# EAGLE schematic Drone (EAGLE 9.3.0)
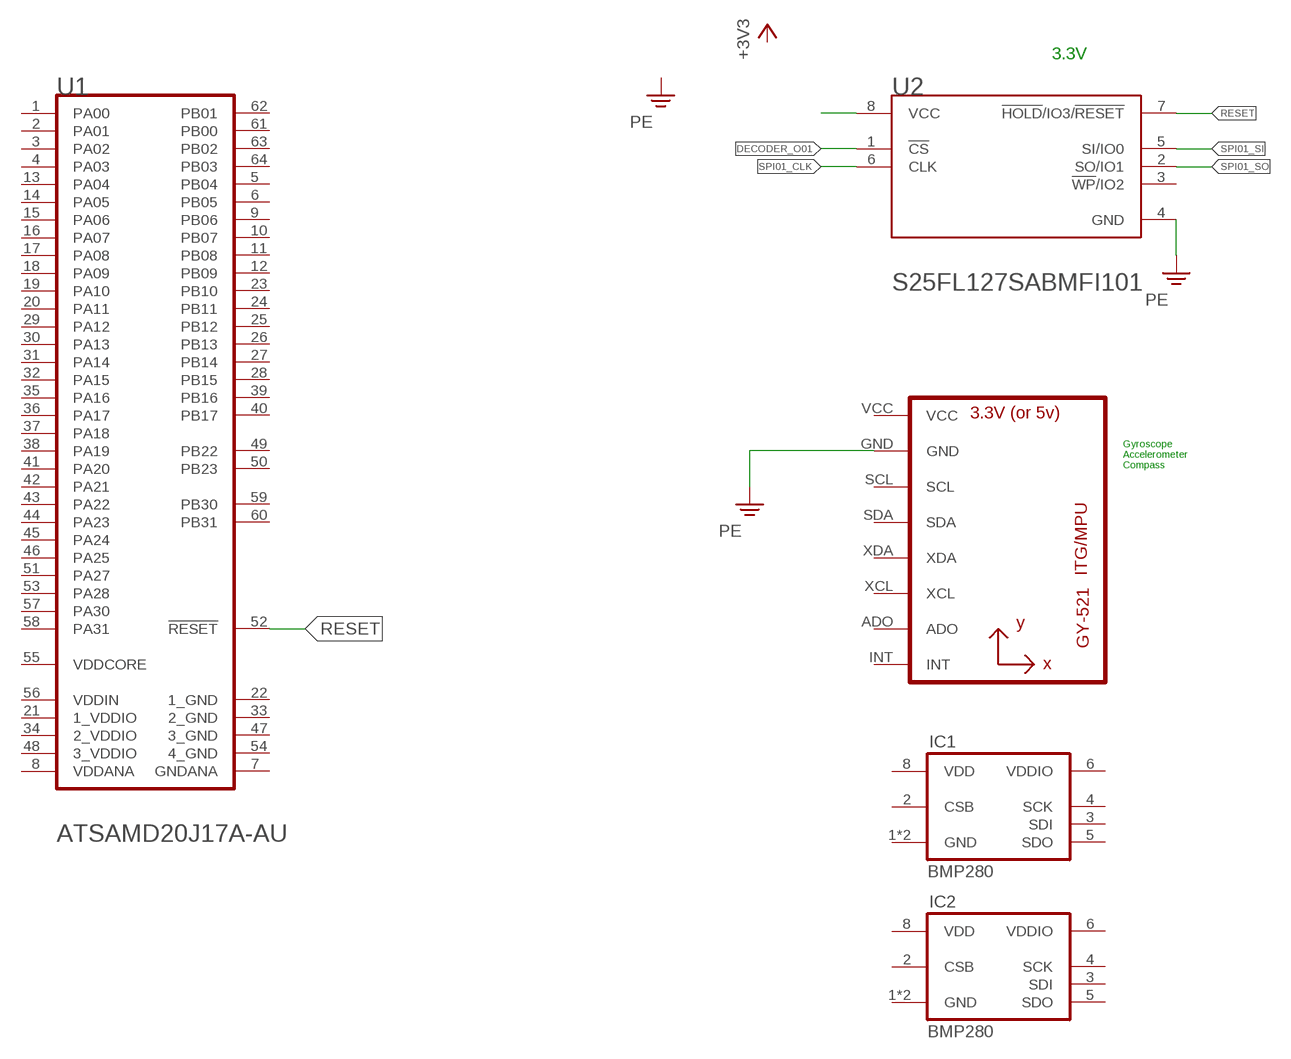
[diagram p0: schematic, sheet 1]

## Parts
IC1  BMP280  [BMP280]
IC2  BMP280  [BMP280]
U1  ATMEL_ATSAMD20J17A-AUATMEL_ATSAMD20J17A-AU_0_0  [ATMEL_ATSAMD20J17A-AU_0]
U2  CYPRESS_S25FL127SABMFI101CYPRESS_S25FL127SABMFI101_0_0  [CYPRESS_S25FL127SABMFI101_0]
U3  GY-521MPU6050  [GY-521]

## Nets
DECODER_O01: U2.1(!CS!)
N$1: U3.GND ; supply symbol labelled PE
N$6: U2.8(VCC)
PE: U2.4(GND)
RESET: U1.52(!RESET!) U2.7(!HOLD!/IO3/!RESET!)
SPI01_CLK: U2.6(CLK)
SPI01_SI: U2.5(SI/IO0)
SPI01_SO: U2.2(SO/IO1)
Unconnected: IC1.2(CSB) IC1.3(SDI) IC1.4(SCK) IC1.5(SDO) IC2.2(CSB) IC2.3(SDI) IC2.4(SCK) IC2.5(SDO) U1.1(PA00) U1.2(PA01) U1.3(PA02) U1.4(PA03) U1.5(PB04) U1.6(PB05) U1.9(PB06) U1.10(PB07) U1.11(PB08) U1.12(PB09) U1.13(PA04) U1.14(PA05) U1.15(PA06) U1.16(PA07) U1.17(PA08) U1.18(PA09) U1.19(PA10) U1.20(PA11) U1.23(PB10) U1.24(PB11) U1.25(PB12) U1.26(PB13) U1.27(PB14) U1.28(PB15) U1.29(PA12) U1.30(PA13) U1.31(PA14) U1.32(PA15) U1.35(PA16) U1.36(PA17) U1.37(PA18) U1.38(PA19) U1.39(PB16) U1.40(PB17) U1.41(PA20) U1.42(PA21) U1.43(PA22) U1.44(PA23) U1.45(PA24) U1.46(PA25) U1.49(PB22) U1.50(PB23) U1.51(PA27) U1.53(PA28) U1.57(PA30) U1.58(PA31) U1.59(PB30) U1.60(PB31) U1.61(PB00) U1.62(PB01) U1.63(PB02) U1.64(PB03) U2.3(!WP!/IO2) U3.ADO U3.INT U3.SCL U3.SDA U3.VCC U3.XCL U3.XDA

## Notes on the sheet
- 3.3V
- Gyroscope
  Accelerometer
  Compass

## Power pins joined to a net without a drawn wire
1_GND: U1.22(1_GND)
1_VDDIO: U1.21(1_VDDIO)
2_GND: U1.33(2_GND)
2_VDDIO: U1.34(2_VDDIO)
3_GND: U1.47(3_GND)
3_VDDIO: U1.48(3_VDDIO)
4_GND: U1.54(4_GND)
GND: IC1.1(GND) IC1.7(GND) IC2.1(GND) IC2.7(GND)
GNDANA: U1.7(GNDANA)
VDD: IC1.8(VDD) IC2.8(VDD)
VDDANA: U1.8(VDDANA)
VDDCORE: U1.55(VDDCORE)
VDDIN: U1.56(VDDIN)
VDDIO: IC1.6(VDDIO) IC2.6(VDDIO)

## Library data of the parts
IC1 IC2 = Drone:BMP280: The BMP280 is an absolute barometric pressure sensor especially designed for mobile applications. The sensor module is housed in an extremely compact 8-pin metal-lid LGA package with a footprint of only 2.0 × 2.5 mm2 and 0.95 mm package height. Its small dimensions and its low power consumption of 2.7 μA @1Hz allow the implementation in battery driven devices such as mobile phones, GPS modules or watches. The library has been designed by Richard Magdycz <https://www.facebook.com/groups/eaglecadsoftUK>
U1 = Drone:ATMEL_ATSAMD20J17A-AU: ATML-ATSAMD20J-TQFP-64; CIIVA_IDS: 12547221; COMPONENT_LINK_1_DESCRIPTION: Manufacturer URL; COMPONENT_LINK_1_URL: http://www.atmel.com/; COMPONENT_LINK_3_DESCRIPTION: Package Specification; COMPONENT_LINK_3_URL: http://www.atmel.com/images/atmel-42129-sam-d20_datasheet.pdf; CPU_FREQUENCY: 48 MHz Max.; DATASHEET: http://www.atmel.com/images/atmel-42129-sam-d20_datasheet.pdf; DATASHEET_VERSION: Rev. N; FLASH_MEMORY_DENSITY: 128 KB; FOOTPRINT_VARIANT_NAME_0: Level C; FOOTPRINT_VARIANT_NAME_1: Level B; FOOTPRINT_VARIANT_NAME_2: Level A; GPIOS: 52; IMPORTED: yes; IMPORTED_FROM: vault; IMPORT_TS: 1521864266; MF: Atmel; MOUNTING_TECHNOLOGY: Surface Mount; MPN: ATSAMD20J17A-AU; PACKAGE_DESCRIPTION: 64-Pin Thin Quad Flat Package, Body 10 x 10 mm, Pitch 0.5 mm; PACKING: Tray; PREFIX: U; RELEASE_DATE: 1433216411; ROHS: Yes; SRAM: 16 KB; TEMPERATURE_RANGE: -40 to 85 degC; VAULT_GUID: 7D63B50C-1B09-490E-BEBA-7AAF9C40A39C; VAULT_REVISION: 941F293A-D347-464E-A457-C88536A4F078; VDD: 1.62 to 3.63 V
U2 = Drone:CYPRESS_S25FL127SABMFI101: 128-Mbit (16 Mbyte) 3.0 V SPI Flash Memory; AMBIENT_TEMPERATURE_RANGE_HIGH: +85°C; AMBIENT_TEMPERATURE_RANGE_LOW: -40°C; CENTROID_NOT_SPECIFIED: No; DATASHEET: http://www.cypress.com/file/177961/download; DEVICE_CLASS_L1: Integrated Circuits (ICs); DEVICE_CLASS_L2: Memory; DEVICE_CLASS_L3: Flash; DIGIKEY_DESCRIPTION: IC FLASH 128MBIT 108MHZ 8SOIC; DIGIKEY_PART_NUMBER: 1274-1045-ND; FOOTPRINT_PARAMETERS_0: {"fp_type":"SOIC_narrow","params":{"N":{"nom":8,"long name":"Number of leads","min":null,"max":null,"short name":"N","type":"count"},"A":{"nom":false,"long name":"Height","min":1750000,"max":2160000,"short name":"A","type":"measurement"},"A1":{"nom":false,"long name":"Package clearance","min":50000,"max":250000,"short name":"A1","type":"measurement"},"A2":{"nom":false,"long name":"Package height","min":1700000,"max":1900000,"short name":"A2","type":"measurement"},"D":{"nom":5280000,"long name":"Package length","min":5080000,"max":5480000,"short name":"D","type":"measurement"},"E":{"nom":8000000,"long name":"Width w/ leads","min":7670000,"max":8330000,"short name":"E","type":"measurement"},"E1":{"nom":5280000,"long name":"Package width","min":5180000,"max":5380000,"short name":"E1","type":"measurement"},"B":{"nom":false,"long name":"Lead width","min":360000,"max":480000,"short name":"B","type":"measurement"},"C":{"nom":false,"long name":"Lead thickness","min":190000,"max":240000,"short name":"C","type":"measurement"},"e":{"nom":1270000,"long name":"Lead pitch","min":null,"max":null,"short name":"e","type":"measurement"},"L":{"nom":false,"long name":"Lead foot length","min":510000,"max":760000,"short name":"L","type":"measurement"},"PHI":{"nom":false,"long name":"Lead foot angle","min":0,"max":8,"short name":"PHI","type":"measurement"},"HT":{"default":"No","long name":"Thermal pad","type":"multichoiceparent","short name":"HT","children":[]},"offset x":{"nom":0,"long name":"X Center offset","min":null,"max":null,"short name":"offset x","type":"measurement"},"offset y":{"nom":0,"long name":"Y Center offset","min":null,"max":null,"short name":"offset y","type":"measurement"},"LS":{"default":"Rounded rectangle","long name":"Land shape","type":"multichoice","short name":"LS"},"LS1":{"default":"Rectangle","long name":"Land shape (Pin 1)","type":"multichoice","short name":"LS1"},"solder toe":{"nom":150000,"long name":"Solder fillet (toe)","min":null,"max":null,"short name":"solder toe","type":"fixedmeasurement"},"solder heel":{"nom":250000,"long name":"Solder fillet (heel)","min":null,"max":null,"short name":"solder heel","type":"fixedmeasurement"},"solder side":{"nom":10000,"long name":"Solder fillet (side)","min":null,"max":null,"short name":"solder side","type":"fixedmeasurement"},"courtyard":{"nom":100000,"long name":"Courtyard","min":null,"max":null,"short name":"courtyard","type":"fixedmeasurement"},"SF":{"default":"C","long name":"Packing level","type":"multichoiceparent","short name":"SF","help":"http://support.upverter.com/customer/portal/articles/978783-what-is-a-footprint-packing-level","children":["solder toe","solder heel","solder side","courtyard"]}}}; FOOTPRINT_URL: http://www.cypress.com/file/217366/download; FREQUENCY: 108MHz; HEIGHT: 2.16mm; INTERFACE: SPI; IPC_LAND_PATTERN_NAME: SOIC127P800X196-8; LEAD_FREE: yes; MAX_SUPPLY_VOLTAGE: 3.6V; MEMORY_SIZE: 16MB; MEMORY_TYPE: FLASH,NOR; MF: Cypress; MFG_PACKAGE_IDENT: 002-15548; MFG_PACKAGE_IDENT_DATE: 0; MFG_PACKAGE_IDENT_REV: 0; MIN_SUPPLY_VOLTAGE: 2.7V; MOUSER_DESCRIPTION: S25FL127S Series 128 Mb (16M x 8) 3 V SMT SPI Serial Flash-NOR Memory - SOIC-8; MOUSER_PART_NUMBER: 797-25FL127SABMFI101; MPN: S25FL127SABMFI101; PACKAGE: SOIC8; PREFIX: U; ROHS: yes; STANDOFF_HEIGHT: 0.05mm; TEMPERATURE_RANGE_HIGH: +85°C; TEMPERATURE_RANGE_LOW: -40°C; VERIFICATION_VERSION: 0.0.0.1
U3 = Drone:GY-521